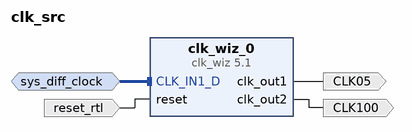
[diagram p0: block diagram of the top level]
# Vivado block design clk_src, Vivado 2014.2
create_bd_design clk_src

create_bd_intf_port -mode Slave -vlnv xilinx.com:interface:diff_clock_rtl:1.0 sys_diff_clock
set_property -dict {CONFIG.FREQ_HZ 200000000} [get_bd_intf_ports sys_diff_clock]
create_bd_port -dir I -type rst reset_rtl
set_property -dict {CONFIG.POLARITY ACTIVE_HIGH} [get_bd_ports reset_rtl]
create_bd_port -dir O -type clk CLK05
set_property -dict {CONFIG.FREQ_HZ 5000000} [get_bd_ports CLK05]
create_bd_port -dir O -type clk CLK100

create_bd_cell -type ip -vlnv xilinx.com:ip:clk_wiz:5.1 clk_wiz_0
set_property -dict [list \
  CONFIG.PRIMITIVE MMCM \
  CONFIG.CLKOUT2_USED true \
  CONFIG.CLKOUT1_REQUESTED_OUT_FREQ 5 \
  CONFIG.USE_BOARD_FLOW true \
  CONFIG.CLK_IN1_BOARD_INTERFACE sys_diff_clock \
] [get_bd_cells clk_wiz_0]

# ---- connections ----

connect_bd_intf_net [get_bd_intf_ports sys_diff_clock] [get_bd_intf_pins clk_wiz_0/CLK_IN1_D]
connect_bd_net [get_bd_ports reset_rtl] [get_bd_pins clk_wiz_0/reset]
connect_bd_net [get_bd_pins clk_wiz_0/clk_out1] [get_bd_ports CLK05]
connect_bd_net [get_bd_pins clk_wiz_0/clk_out2] [get_bd_ports CLK100]

validate_bd_design
save_bd_design
